# EAGLE design a-star_dual_drv8801_fab (EAGLE 7.1.0)
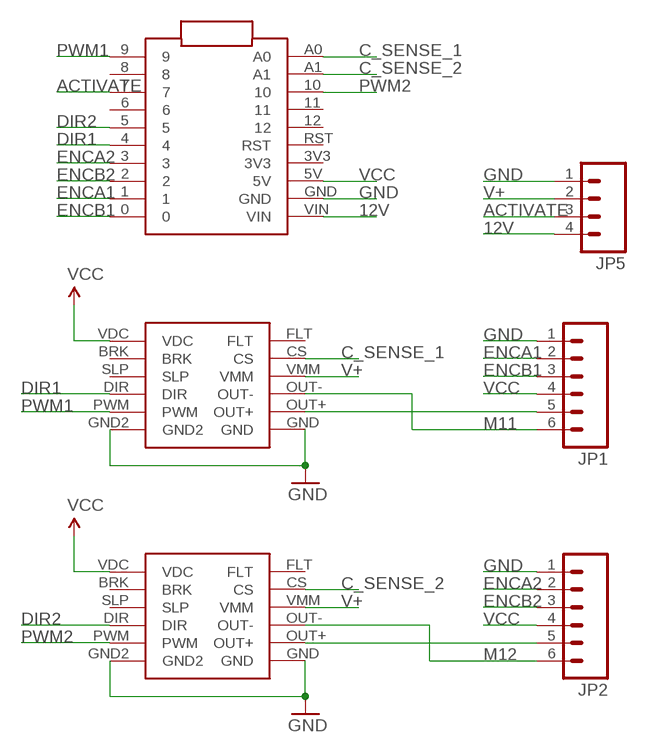
[diagram p0: schematic, sheet 1]

## Parts
JP1  M06POLAR  [MOLEX-1X6]
JP2  M06POLAR  [MOLEX-1X6]
JP5  M04POLAR  [MOLEX-1X4]
U$1  POLOLU_DRV8801_CARRIER  [POLOLU_DRV8801_CARRIER]
U$2  POLOLU_A-STAR-MICRO  [POLOLU_A-STAR-MICRO]
U$3  POLOLU_DRV8801_CARRIER  [POLOLU_DRV8801_CARRIER]

## Nets
12V: JP5.4 U$2.VIN
ACTIVATE: JP5.3 U$2.7
C_SENSE_1: U$1.CS U$2.A0
C_SENSE_2: U$2.A1 U$3.CS
DIR1: U$1.DIR U$2.4
DIR2: U$2.5 U$3.DIR
ENCA1: JP1.2 U$2.1
ENCA2: JP2.2 U$2.3
ENCB1: JP1.3 U$2.0
ENCB2: JP2.3 U$2.2
GND: JP1.1 JP2.1 JP5.1 U$1.GND U$1.GND2 U$2.GND U$3.GND U$3.GND2
M11: JP1.6 U$1.OUT-
M12: JP2.6 U$3.OUT-
N$2: JP2.5 U$3.OUT+
N$4: JP1.5 U$1.OUT+
PWM1: U$1.PWM U$2.9
PWM2: U$2.10 U$3.PWM
V+: JP5.2 U$1.VMM U$3.VMM
VCC: JP1.4 JP2.4 U$1.VDC U$2.5V U$3.VDC
Unconnected: U$1.BRK U$1.FLT U$1.SLP U$2.3V3 U$2.6 U$2.8 U$2.11 U$2.12 U$2.RST U$3.BRK U$3.FLT U$3.SLP

## Library data of the parts
JP1 JP2 = SparkFun:M06: Header 6 Standard 6-pin 0.1" header. Use with straight break away headers (SKU : PRT-00116), right angle break away headers (PRT-00553), swiss pins (PRT-00743), machine pins (PRT-00117), and female headers (PRT-00115). Molex polarized connector foot print use with SKU : PRT-08094 with associated crimp pins and housings. NOTES ON THE VARIANTS LOCK and LOCK_LONGPADS... This footprint was designed to help hold the alignment of a through-hole component (i.e. 6-pin header) while soldering it into place. You may notice that each hole has been shifted either up or down by 0.005 of an inch from it's more standard position (which is a perfectly straight line). This slight alteration caused the pins (the squares in the middle) to touch the edges of the holes. Because they are alternating, it causes a "brace" to hold the component in place. 0.005 has proven to be the perfect amount of "off-center" position when using our standard breakaway headers. Although looks a little odd when you look at the bare footprint, once you have a header in there, the alteration is very hard to notice. Also, if you push a header all the way into place, it is covered up entirely on the bottom side. This idea of altering the position of holes to aid alignment will be further integrated into the Sparkfun Library for other footprints. It can help hold any component with 3 or more connection pins.
JP5 = SparkFun:M04: Header 4 Standard 4-pin 0.1" header. Use with straight break away headers (SKU : PRT-00116), right angle break away headers (PRT-00553), swiss pins (PRT-00743), machine pins (PRT-00117), and female headers (PRT-00115). Molex polarized connector foot print use with SKU : PRT-08231 with associated crimp pins and housings.
U$1 U$3 = will:POLOLU_DRV8801_CARRIER
U$2 = will:POLOLU_A-STAR-MICRO

## Board
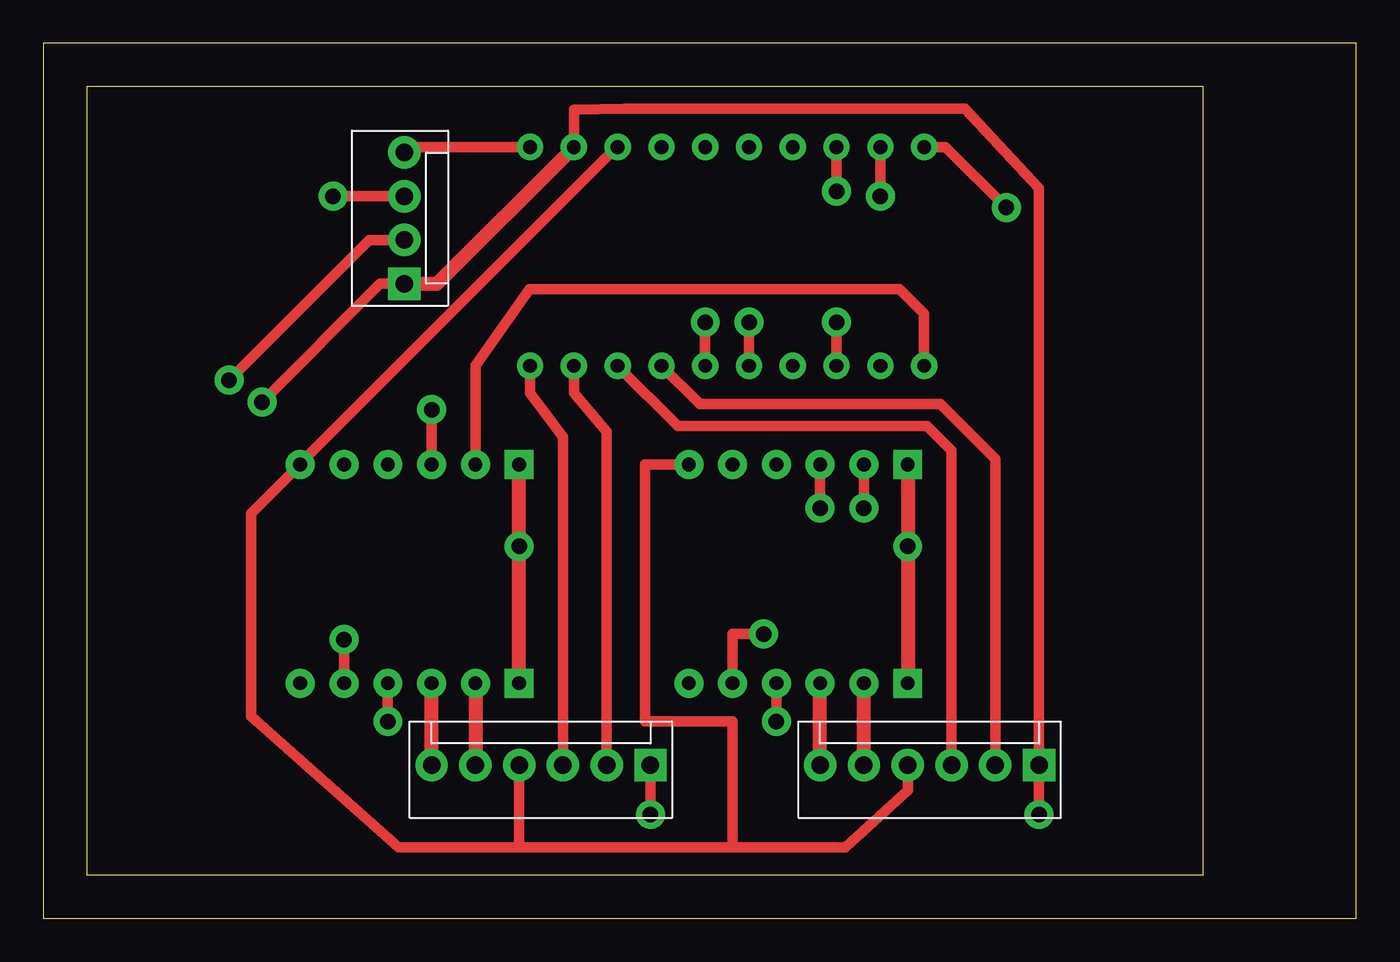
[diagram p1: board, top side]
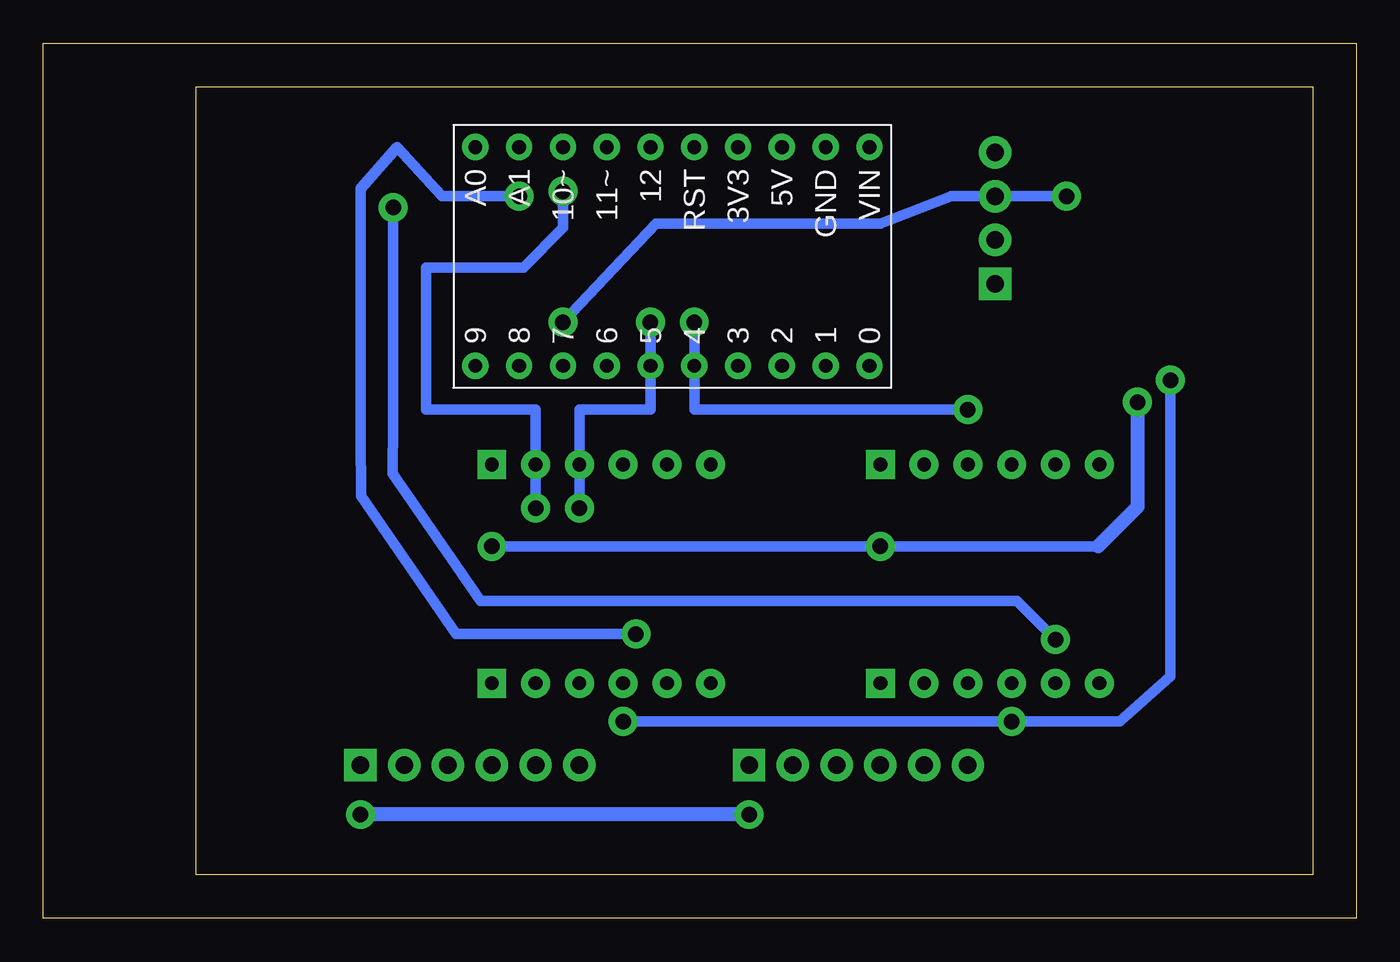
[diagram p2: board, bottom side, seen from below]

Size 76.2 x 50.8 mm. Coordinates in mm from the lower left corner, seen from the top.
Outline: 0,0 76.2,0 76.2,50.8 0,50.8 0,0
Copper layers (1*16): Top 0.035mm / dielectric 1.5mm / Bottom 0.035mm
Design rules "fab *": minimum track width 0.3mm, minimum drill 32mil, track to track 0.4mm, track to pad 0.4mm, pad to pad 0.4mm, via to via 0.4mm, smd to smd 0.4mm, copper to edge 40mil, drill to drill 16mil, minimum pad ring 10mil, minimum via ring 8mil, stop-mask expansion 4mil, vias tented up to drill 0mil, thermal gap 10mil
Milling: area 2.5,2.5 to 67.3,48.3

### Footprints (pad centres in the part's own frame; a part is rotated, then mirrored left to right if it is on the bottom)
MOLEX-1X6 = drill 1.016 pad 1.88 square: 1 0,0 | drill 1.016 pad 1.88: 2 2.54,0; 3 5.08,0; 4 7.62,0; 5 10.16,0; 6 12.7,0
MOLEX-1X4 = drill 1.016 pad 1.88 square: 1 0,0 | drill 1.016 pad 1.88: 2 2.54,0; 3 5.08,0; 4 7.62,0
POLOLU_DRV8801_CARRIER = drill 0.8 pad 1.676: BRK -6.35,3.81; CS 6.35,3.81; DIR -6.35,-1.27; FLT 6.35,6.35; OUT+ 6.35,-3.81; OUT- 6.35,-1.27; PWM -6.35,-3.81; SLP -6.35,1.27; VDC -6.35,6.35; VMM 6.35,1.27 | drill 0.8 pad 1.676 square: GND 6.35,-6.35; GND2 -6.35,-6.35
POLOLU_A-STAR-MICRO = drill 0.8 pad 1.524: 0 -6.35,-12.7; 1 -6.35,-10.16; 2 -6.35,-7.62; 3 -6.35,-5.08; 3V3 6.35,-5.08; 4 -6.35,-2.54; 5 -6.35,0; 5V 6.35,-7.62; 6 -6.35,2.54; 7 -6.35,5.08; 8 -6.35,7.62; 9 -6.35,10.16; 10 6.35,5.08; 11 6.35,2.54; 12 6.35,0; A0 6.35,10.16; A1 6.35,7.62; GND 6.35,-10.16; RST 6.35,-2.54; VIN 6.35,-12.7

### Placement (x,y rotation side)
JP1  35.24,8.89 180 top
JP2  57.78,8.89 180 top
JP5  20.95,36.83 90 top
U$1  21.27,20 270 bottom
U$2  40.96,38.42 90 bottom
U$3  43.81,20 270 bottom

### Tracks (layer width: path | path; a pad name or v marks a point on that pad's centre or on a via)
12V
  Top 0.61: JP5.4 20.95,44.77 U$2.VIN
ACTIVATE  (via drill 0.9 pad 1.68)
  Top 0.61: JP5.3 v16.83,41.91 | v46.04,34.61 U$2.7
  Bottom 0.61: v16.83,41.91 23.5,41.91 27.62,40.32 40.64,40.32 v46.04,34.61
C_SENSE_1  (via drill 0.9 pad 1.68)
  Top 0.61: v17.46,16.19 U$1.CS | U$2.A0 52.37,44.77 v55.88,41.26
  Bottom 0.61: v55.88,41.26 55.88,28.77 55.91,25.83 50.8,18.41 19.68,18.41 v17.46,16.19
C_SENSE_2  (via drill 0.9 pad 1.68)
  Top 0.61: U$2.A1 v48.58,41.91 | U$3.CS 40.01,16.51 v41.8,16.51
  Bottom 0.61: v48.58,41.91 53.04,41.91 55.65,44.77 57.78,42.34 57.78,28.03 57.76,24.51 52.24,16.51 v41.8,16.51
DIR1  (via drill 0.9 pad 1.68)
  Top 0.61: U$1.DIR v22.54,29.53 | v38.42,34.61 U$2.4
  Bottom 0.61: v22.54,29.53 38.42,29.53 v38.42,34.61
DIR2  (via drill 0.9 pad 1.68)
  Top 0.61: U$3.DIR v45.09,23.81 | v40.96,34.61 U$2.5
  Bottom 0.61: v45.09,23.81 45.09,29.53 40.96,29.53 v40.96,34.61
ENCA1
  Top 0.61: JP1.2 32.7,28.26 30.8,30.48 U$2.1
ENCA2
  Top 0.61: JP2.2 55.24,26.67 52.07,29.84 38.1,29.84 U$2.3
ENCB1
  Top 0.61: JP1.3 30.16,27.94 28.26,30.48 U$2.0
ENCB2
  Top 0.61: JP2.3 52.7,27.16 51.28,28.57 36.83,28.57 U$2.2
GND  (via drill 0.9 pad 1.68)
  Top 0.61: JP5.1 19.57,36.83 v12.7,29.96 | JP1.1 v35.24,6.03 | v57.78,6.03 JP2.1 57.78,42.38 53.49,46.99 33.73,46.99 30.8,46.92 U$2.GND
  Top 0.813: U$1.GND v27.62,21.59 U$1.GND2 | U$2.GND 22.86,36.83 JP5.1 | U$3.GND2 v50.16,21.59 U$3.GND
  Bottom 0.61: 14.99,21.59 v27.62,21.59 v50.16,21.59
  Bottom 0.813: v35.24,6.03 v57.78,6.03 | v12.7,29.96 12.7,23.88 14.99,21.59
M11
  Top 0.813: JP1.6 U$1.OUT-
M12
  Top 0.813: JP2.6 U$3.OUT-
N$2
  Top 0.813: JP2.5 U$3.OUT+
N$4
  Top 0.813: U$1.OUT+ JP1.5
PWM1
  Top 0.61: U$1.PWM 25.08,32.1 28.23,36.51 49.7,36.51 51.12,35.09 U$2.9
PWM2  (via drill 0.9 pad 1.68)
  Top 0.61: v46.04,42.2 U$2.10 | v47.62,23.81 U$3.PWM
  Bottom 0.61: v46.04,42.2 46.03,40.1 48.34,37.78 53.98,37.78 53.98,29.53 47.62,29.53 v47.62,23.81
V+  (via drill 0.9 pad 1.68)
  Top 0.61: JP5.2 18.93,39.37 v10.79,31.24 | U$1.VMM v20,11.43 | U$3.VMM v42.55,11.43
  Bottom 0.61: v42.55,11.43 v20,11.43 13.72,11.43 10.79,14.04 v10.79,31.24
VCC
  Top 0.61: JP1.4 27.62,4.13 | 27.62,4.13 40.01,4.13 | 40.01,4.13 46.55,4.13 50.16,7.43 JP2.4 | 27.62,4.13 20.63,4.13 12.06,11.74 12.06,23.5 U$1.VDC 14.92,26.41 33.34,44.83 U$2.5V | U$3.VDC 34.92,26.35 34.92,11.43 40.01,11.43 40.01,4.13